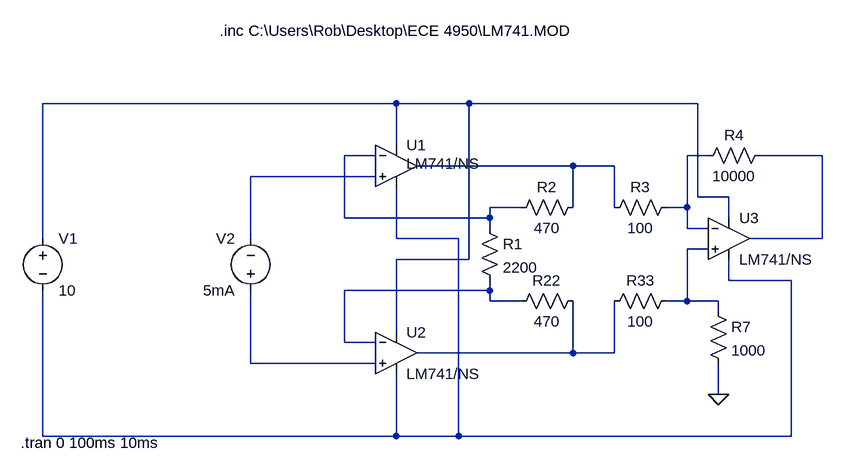
[diagram p0: schematic Instr_Amp.asc]
Instr_Amp.asc, the LTspice schematic file:
Version 4
SHEET 1 880 680
WIRE -32 -64 -576 -64
WIRE 80 -64 -32 -64
WIRE 432 -64 80 -64
WIRE -32 0 -32 -64
WIRE -64 16 -112 16
WIRE 448 16 416 16
WIRE 624 16 528 16
WIRE 240 32 0 32
WIRE 304 32 240 32
WIRE -64 48 -256 48
WIRE 432 80 432 -64
WIRE 480 80 432 80
WIRE 160 96 112 96
WIRE 240 96 240 32
WIRE 304 96 304 32
WIRE 416 96 416 16
WIRE 416 96 384 96
WIRE -112 112 -112 16
WIRE 112 112 112 96
WIRE 112 112 -112 112
WIRE 480 112 480 80
WIRE 112 128 112 112
WIRE 416 128 416 96
WIRE 448 128 416 128
WIRE -576 144 -576 -64
WIRE -256 144 -256 48
WIRE -32 144 -32 64
WIRE 64 144 -32 144
WIRE 624 144 624 16
WIRE 624 144 512 144
WIRE 448 160 416 160
WIRE 80 176 80 -64
WIRE 80 176 -32 176
WIRE 480 208 480 176
WIRE 576 208 480 208
WIRE 112 224 112 208
WIRE 112 224 -112 224
WIRE 112 240 112 224
WIRE 160 240 112 240
WIRE 416 240 416 160
WIRE 416 240 384 240
WIRE 464 240 416 240
WIRE 464 256 464 240
WIRE -32 288 -32 176
WIRE -112 304 -112 224
WIRE -64 304 -112 304
WIRE 240 320 240 240
WIRE 240 320 0 320
WIRE 304 320 304 240
WIRE 304 320 240 320
WIRE -256 336 -256 224
WIRE -64 336 -256 336
WIRE 464 384 464 336
WIRE -576 448 -576 224
WIRE -32 448 -32 352
WIRE -32 448 -576 448
WIRE 64 448 64 144
WIRE 64 448 -32 448
WIRE 576 448 576 208
WIRE 576 448 64 448
FLAG 464 384 0
SYMBOL res 96 112 R0
SYMATTR InstName R1
SYMATTR Value 2200
SYMBOL Opamps\\opamp2 -32 -32 R0
WINDOW 3 16 60 Left 2
SYMATTR InstName U1
SYMATTR Value LM741/NS
SYMBOL Opamps\\opamp2 -32 256 R0
SYMATTR InstName U2
SYMATTR Value LM741/NS
SYMBOL Opamps\\opamp2 480 80 R0
SYMATTR InstName U3
SYMATTR Value LM741/NS
SYMBOL res 256 80 R90
WINDOW 0 0 56 VBottom 2
WINDOW 3 32 56 VTop 2
SYMATTR InstName R2
SYMATTR Value 470
SYMBOL res 400 80 R90
WINDOW 0 0 56 VBottom 2
WINDOW 3 32 56 VTop 2
SYMATTR InstName R3
SYMATTR Value 100
SYMBOL res 400 224 R90
WINDOW 0 0 56 VBottom 2
WINDOW 3 32 56 VTop 2
SYMATTR InstName R33
SYMATTR Value 100
SYMBOL res 544 0 R90
WINDOW 0 0 56 VBottom 2
WINDOW 3 32 56 VTop 2
SYMATTR InstName R4
SYMATTR Value 10000
SYMBOL res 448 240 R0
SYMATTR InstName R7
SYMATTR Value 1000
SYMBOL res 256 224 R90
WINDOW 0 0 56 VBottom 2
WINDOW 3 32 56 VTop 2
SYMATTR InstName R22
SYMATTR Value 470
SYMBOL voltage -576 128 R0
WINDOW 123 0 0 Left 0
WINDOW 39 0 0 Left 0
SYMATTR InstName V1
SYMATTR Value 10
SYMBOL voltage -256 240 R180
WINDOW 0 24 96 Left 2
WINDOW 3 24 16 Left 2
SYMATTR InstName V2
SYMATTR Value 5mA
TEXT -304 -176 Left 2 !.inc C:\\Users\\Rob\\Desktop\\ECE 4950\\LM741.MOD
TEXT -610 458 Left 2 !.tran 0 100ms 10ms

The netlist it stands for:
* Instr_Amp.asc
R1 N002 N009 2200
XU1 N006 N002 N001 N007 N005 LM741/NS  ; pins In+ In- V+ V- OUT
XU2 N011 N009 N001 N007 N010 LM741/NS  ; pins In+ In- V+ V- OUT
XU3 N008 N003 N001 N007 N004 LM741/NS  ; pins In+ In- V+ V- OUT
R2 N005 N002 470
R3 N003 N005 100
R33 N008 N010 100
R4 N004 N003 10000
R7 N008 0 1000
R22 N010 N009 470
V1 N001 N007 10
V2 N011 N006 5mA
.inc C:\Users\Rob\Desktop\ECE 4950\LM741.MOD
.tran 0 100ms 10ms
.backanno
.end